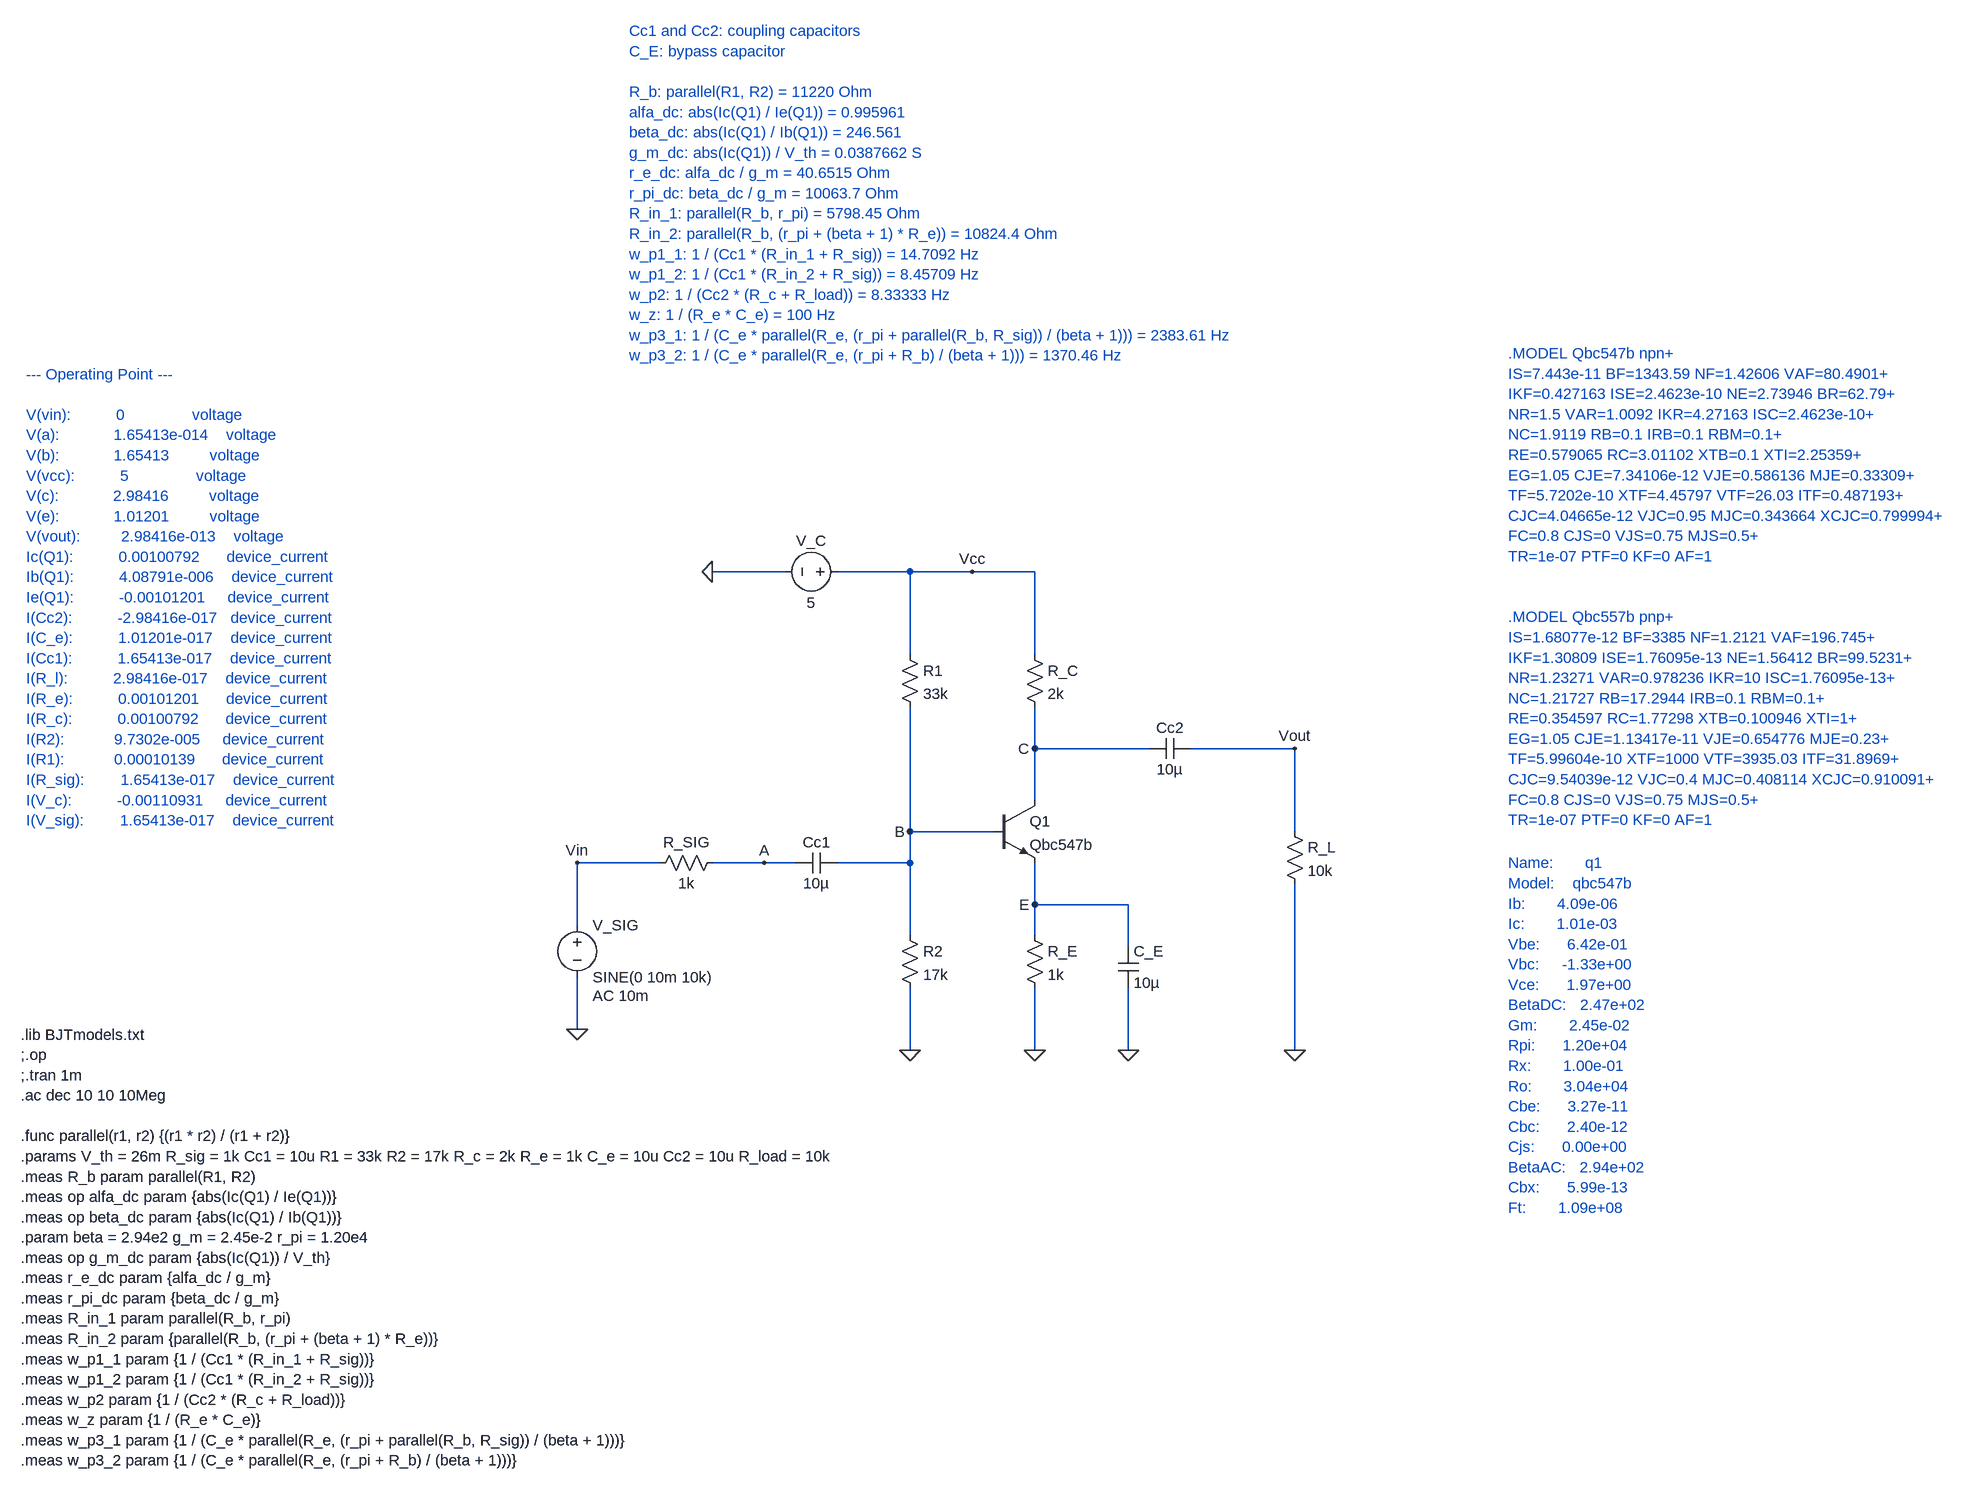
[diagram p0: schematic CE_amp.asc]
CE_amp.asc, the LTspice schematic file:
Version 4
SHEET 1 2012 980
WIRE 176 -336 64 -336
WIRE 368 -336 256 -336
WIRE 464 -336 368 -336
WIRE 560 -336 464 -336
WIRE 368 -208 368 -336
WIRE 560 -208 560 -336
WIRE 560 -64 560 -128
WIRE 736 -64 560 -64
WIRE 960 -64 800 -64
WIRE 560 16 560 -64
WIRE 368 64 368 -128
WIRE 496 64 368 64
WIRE 960 64 960 -64
WIRE -16 112 -144 112
WIRE 144 112 64 112
WIRE 192 112 144 112
WIRE 368 112 368 64
WIRE 368 112 256 112
WIRE 560 176 560 112
WIRE 704 176 560 176
WIRE -144 208 -144 112
WIRE 368 224 368 112
WIRE 560 224 560 176
WIRE 704 240 704 176
WIRE -144 368 -144 288
WIRE 368 400 368 304
WIRE 560 400 560 304
WIRE 704 400 704 304
WIRE 960 400 960 144
FLAG -144 368 0
FLAG 368 400 0
FLAG 64 -336 0
FLAG 560 400 0
FLAG 704 400 0
FLAG 960 400 0
FLAG 560 -64 C
FLAG 560 176 E
FLAG 368 64 B
FLAG -144 112 Vin
FLAG 144 112 A
FLAG 960 -64 Vout
FLAG 464 -336 Vcc
SYMBOL voltage -144 192 R0
WINDOW 123 24 124 Left 2
WINDOW 39 0 0 Left 0
SYMATTR Value2 AC 10m
SYMATTR InstName V_SIG
SYMATTR Value SINE(0 10m 10k)
SYMBOL res 80 96 R90
WINDOW 0 0 56 VBottom 2
WINDOW 3 32 56 VTop 2
SYMATTR InstName R_SIG
SYMATTR Value 1k
SYMBOL cap 256 96 R90
WINDOW 0 0 32 VBottom 2
WINDOW 3 32 32 VTop 2
SYMATTR InstName Cc1
SYMATTR Value 10µ
SYMBOL res 352 -224 R0
SYMATTR InstName R1
SYMATTR Value 33k
SYMBOL res 352 208 R0
SYMATTR InstName R2
SYMATTR Value 17k
SYMBOL voltage 272 -336 R90
WINDOW 0 -32 56 VBottom 2
WINDOW 3 32 56 VTop 2
SYMATTR InstName V_C
SYMATTR Value 5
SYMBOL res 544 -224 R0
SYMATTR InstName R_C
SYMATTR Value 2k
SYMBOL res 544 208 R0
SYMATTR InstName R_E
SYMATTR Value 1k
SYMBOL cap 688 240 R0
SYMATTR InstName C_E
SYMATTR Value 10µ
SYMBOL cap 800 -80 R90
WINDOW 0 0 32 VBottom 2
WINDOW 3 32 32 VTop 2
SYMATTR InstName Cc2
SYMATTR Value 10µ
SYMBOL res 944 48 R0
SYMATTR InstName R_L
SYMATTR Value 10k
SYMBOL npn 496 16 R0
SYMATTR InstName Q1
SYMATTR Value Qbc547b
TEXT -1000 376 Left 2 !.lib BJTmodels.txt\n;.op\n;.tran 1m\n.ac dec 10 10 10Meg\n \n.func parallel(r1, r2) {(r1 * r2) / (r1 + r2)}\n.params V_th = 26m R_sig = 1k Cc1 = 10u R1 = 33k R2 = 17k R_c = 2k R_e = 1k C_e = 10u Cc2 = 10u R_load = 10k\n.meas R_b param parallel(R1, R2)\n.meas op alfa_dc param {abs(Ic(Q1) / Ie(Q1))}\n.meas op beta_dc param {abs(Ic(Q1) / Ib(Q1))}\n.param beta = 2.94e2 g_m = 2.45e-2 r_pi = 1.20e4\n.meas op g_m_dc param {abs(Ic(Q1)) / V_th}\n.meas r_e_dc param {alfa_dc / g_m}\n.meas r_pi_dc param {beta_dc / g_m}\n.meas R_in_1 param parallel(R_b, r_pi)\n.meas R_in_2 param {parallel(R_b, (r_pi + (beta + 1) * R_e))}\n.meas w_p1_1 param {1 / (Cc1 * (R_in_1 + R_sig))}\n.meas w_p1_2 param {1 / (Cc1 * (R_in_2 + R_sig))}\n.meas w_p2 param {1 / (Cc2 * (R_c + R_load))}\n.meas w_z param {1 / (R_e * C_e)}\n.meas w_p3_1 param {1 / (C_e * parallel(R_e, (r_pi + parallel(R_b, R_sig)) / (beta + 1)))}\n.meas w_p3_2 param {1 / (C_e * parallel(R_e, (r_pi + R_b) / (beta + 1)))}
TEXT 1288 -672 Left 2 ;.MODEL Qbc547b npn+\nIS=7.443e-11 BF=1343.59 NF=1.42606 VAF=80.4901+\nIKF=0.427163 ISE=2.4623e-10 NE=2.73946 BR=62.79+\nNR=1.5 VAR=1.0092 IKR=4.27163 ISC=2.4623e-10+\nNC=1.9119 RB=0.1 IRB=0.1 RBM=0.1+\nRE=0.579065 RC=3.01102 XTB=0.1 XTI=2.25359+\nEG=1.05 CJE=7.34106e-12 VJE=0.586136 MJE=0.33309+\nTF=5.7202e-10 XTF=4.45797 VTF=26.03 ITF=0.487193+\nCJC=4.04665e-12 VJC=0.95 MJC=0.343664 XCJC=0.799994+\nFC=0.8 CJS=0 VJS=0.75 MJS=0.5+\nTR=1e-07 PTF=0 KF=0 AF=1\n \n \n.MODEL Qbc557b pnp+\nIS=1.68077e-12 BF=3385 NF=1.2121 VAF=196.745+\nIKF=1.30809 ISE=1.76095e-13 NE=1.56412 BR=99.5231+\nNR=1.23271 VAR=0.978236 IKR=10 ISC=1.76095e-13+\nNC=1.21727 RB=17.2944 IRB=0.1 RBM=0.1+\nRE=0.354597 RC=1.77298 XTB=0.100946 XTI=1+\nEG=1.05 CJE=1.13417e-11 VJE=0.654776 MJE=0.23+\nTF=5.99604e-10 XTF=1000 VTF=3935.03 ITF=31.8969+\nCJC=9.54039e-12 VJC=0.4 MJC=0.408114 XCJC=0.910091+\nFC=0.8 CJS=0 VJS=0.75 MJS=0.5+\nTR=1e-07 PTF=0 KF=0 AF=1
TEXT -64 -1168 Left 2 ;Cc1 and Cc2: coupling capacitors\nC_E: bypass capacitor\n \nR_b: parallel(R1, R2) = 11220 Ohm\nalfa_dc: abs(Ic(Q1) / Ie(Q1)) = 0.995961\nbeta_dc: abs(Ic(Q1) / Ib(Q1)) = 246.561\ng_m_dc: abs(Ic(Q1)) / V_th = 0.0387662 S\nr_e_dc: alfa_dc / g_m = 40.6515 Ohm\nr_pi_dc: beta_dc / g_m = 10063.7 Ohm\nR_in_1: parallel(R_b, r_pi) = 5798.45 Ohm\nR_in_2: parallel(R_b, (r_pi + (beta + 1) * R_e)) = 10824.4 Ohm\nw_p1_1: 1 / (Cc1 * (R_in_1 + R_sig)) = 14.7092 Hz\nw_p1_2: 1 / (Cc1 * (R_in_2 + R_sig)) = 8.45709 Hz\nw_p2: 1 / (Cc2 * (R_c + R_load)) = 8.33333 Hz\nw_z: 1 / (R_e * C_e) = 100 Hz\nw_p3_1: 1 / (C_e * parallel(R_e, (r_pi + parallel(R_b, R_sig)) / (beta + 1))) = 2383.61 Hz\nw_p3_2: 1 / (C_e * parallel(R_e, (r_pi + R_b) / (beta + 1))) = 1370.46 Hz
TEXT -992 -640 Left 2 ;--- Operating Point ---\n \nV(vin):          0               voltage\nV(a):            1.65413e-014    voltage\nV(b):            1.65413         voltage\nV(vcc):          5               voltage\nV(c):            2.98416         voltage\nV(e):            1.01201         voltage\nV(vout):         2.98416e-013    voltage\nIc(Q1):          0.00100792      device_current\nIb(Q1):          4.08791e-006    device_current\nIe(Q1):          -0.00101201     device_current\nI(Cc2):          -2.98416e-017   device_current\nI(C_e):          1.01201e-017    device_current\nI(Cc1):          1.65413e-017    device_current\nI(R_l):          2.98416e-017    device_current\nI(R_e):          0.00101201      device_current\nI(R_c):          0.00100792      device_current\nI(R2):           9.7302e-005     device_current\nI(R1):           0.00010139      device_current\nI(R_sig):        1.65413e-017    device_current\nI(V_c):          -0.00110931     device_current\nI(V_sig):        1.65413e-017    device_current
TEXT 1288 112 Left 2 ;Name:       q1\nModel:    qbc547b\nIb:       4.09e-06\nIc:       1.01e-03\nVbe:      6.42e-01\nVbc:     -1.33e+00\nVce:      1.97e+00\nBetaDC:   2.47e+02\nGm:       2.45e-02\nRpi:      1.20e+04\nRx:       1.00e-01\nRo:       3.04e+04\nCbe:      3.27e-11\nCbc:      2.40e-12\nCjs:      0.00e+00\nBetaAC:   2.94e+02\nCbx:      5.99e-13\nFt:       1.09e+08

The netlist it stands for:
* CE_amp.asc
V_SIG Vin 0 SINE(0 10m 10k) AC 10m
R_SIG A Vin 1k
Cc1 B A 10µ
R1 Vcc B 33k
R2 B 0 17k
V_C Vcc 0 5
R_C Vcc C 2k
R_E E 0 1k
C_E E 0 10µ
Cc2 Vout C 10µ
R_L Vout 0 10k
Q1 C B E 0 Qbc547b
.model NPN NPN
.model PNP PNP
.lib standard.bjt
.lib BJTmodels.txt
;.op
;.tran 1m
.ac dec 10 10 10Meg
.func parallel(r1, r2) {(r1 * r2) / (r1 + r2)}
.params V_th = 26m R_sig = 1k Cc1 = 10u R1 = 33k R2 = 17k R_c = 2k R_e = 1k C_e = 10u Cc2 = 10u R_load = 10k
.meas R_b param parallel(R1, R2)
.meas op alfa_dc param {abs(Ic(Q1) / Ie(Q1))}
.meas op beta_dc param {abs(Ic(Q1) / Ib(Q1))}
.param beta = 2.94e2 g_m = 2.45e-2 r_pi = 1.20e4
.meas op g_m_dc param {abs(Ic(Q1)) / V_th}
.meas r_e_dc param {alfa_dc / g_m}
.meas r_pi_dc param {beta_dc / g_m}
.meas R_in_1 param parallel(R_b, r_pi)
.meas R_in_2 param {parallel(R_b, (r_pi + (beta + 1) * R_e))}
.meas w_p1_1 param {1 / (Cc1 * (R_in_1 + R_sig))}
.meas w_p1_2 param {1 / (Cc1 * (R_in_2 + R_sig))}
.meas w_p2 param {1 / (Cc2 * (R_c + R_load))}
.meas w_z param {1 / (R_e * C_e)}
.meas w_p3_1 param {1 / (C_e * parallel(R_e, (r_pi + parallel(R_b, R_sig)) / (beta + 1)))}
.meas w_p3_2 param {1 / (C_e * parallel(R_e, (r_pi + R_b) / (beta + 1)))}
* .MODEL Qbc547b npn+
* IS=7.443e-11 BF=1343.59 NF=1.42606 VAF=80.4901+
* IKF=0.427163 ISE=2.4623e-10 NE=2.73946 BR=62.79+
* NR=1.5 VAR=1.0092 IKR=4.27163 ISC=2.4623e-10+
* NC=1.9119 RB=0.1 IRB=0.1 RBM=0.1+
* RE=0.579065 RC=3.01102 XTB=0.1 XTI=2.25359+
* EG=1.05 CJE=7.34106e-12 VJE=0.586136 MJE=0.33309+
* TF=5.7202e-10 XTF=4.45797 VTF=26.03 ITF=0.487193+
* CJC=4.04665e-12 VJC=0.95 MJC=0.343664 XCJC=0.799994+
* FC=0.8 CJS=0 VJS=0.75 MJS=0.5+
* TR=1e-07 PTF=0 KF=0 AF=1
* .MODEL Qbc557b pnp+
* IS=1.68077e-12 BF=3385 NF=1.2121 VAF=196.745+
* IKF=1.30809 ISE=1.76095e-13 NE=1.56412 BR=99.5231+
* NR=1.23271 VAR=0.978236 IKR=10 ISC=1.76095e-13+
* NC=1.21727 RB=17.2944 IRB=0.1 RBM=0.1+
* RE=0.354597 RC=1.77298 XTB=0.100946 XTI=1+
* EG=1.05 CJE=1.13417e-11 VJE=0.654776 MJE=0.23+
* TF=5.99604e-10 XTF=1000 VTF=3935.03 ITF=31.8969+
* CJC=9.54039e-12 VJC=0.4 MJC=0.408114 XCJC=0.910091+
* FC=0.8 CJS=0 VJS=0.75 MJS=0.5+
* TR=1e-07 PTF=0 KF=0 AF=1
* Cc1 and Cc2: coupling capacitors
* C_E: bypass capacitor
* R_b: parallel(R1, R2) = 11220 Ohm
* alfa_dc: abs(Ic(Q1) / Ie(Q1)) = 0.995961
* beta_dc: abs(Ic(Q1) / Ib(Q1)) = 246.561
* g_m_dc: abs(Ic(Q1)) / V_th = 0.0387662 S
* r_e_dc: alfa_dc / g_m = 40.6515 Ohm
* r_pi_dc: beta_dc / g_m = 10063.7 Ohm
* R_in_1: parallel(R_b, r_pi) = 5798.45 Ohm
* R_in_2: parallel(R_b, (r_pi + (beta + 1) * R_e)) = 10824.4 Ohm
* w_p1_1: 1 / (Cc1 * (R_in_1 + R_sig)) = 14.7092 Hz
* w_p1_2: 1 / (Cc1 * (R_in_2 + R_sig)) = 8.45709 Hz
* w_p2: 1 / (Cc2 * (R_c + R_load)) = 8.33333 Hz
* w_z: 1 / (R_e * C_e) = 100 Hz
* w_p3_1: 1 / (C_e * parallel(R_e, (r_pi + parallel(R_b, R_sig)) / (beta + 1))) = 2383.61 Hz
* w_p3_2: 1 / (C_e * parallel(R_e, (r_pi + R_b) / (beta + 1))) = 1370.46 Hz
* --- Operating Point ---
* V(vin):          0               voltage
* V(a):            1.65413e-014    voltage
* V(b):            1.65413         voltage
* V(vcc):          5               voltage
* V(c):            2.98416         voltage
* V(e):            1.01201         voltage
* V(vout):         2.98416e-013    voltage
* Ic(Q1):          0.00100792      device_current
* Ib(Q1):          4.08791e-006    device_current
* Ie(Q1):          -0.00101201     device_current
* I(Cc2):          -2.98416e-017   device_current
* I(C_e):          1.01201e-017    device_current
* I(Cc1):          1.65413e-017    device_current
* I(R_l):          2.98416e-017    device_current
* I(R_e):          0.00101201      device_current
* I(R_c):          0.00100792      device_current
* I(R2):           9.7302e-005     device_current
* I(R1):           0.00010139      device_current
* I(R_sig):        1.65413e-017    device_current
* I(V_c):          -0.00110931     device_current
* I(V_sig):        1.65413e-017    device_current
* Name:       q1
* Model:    qbc547b
* Ib:       4.09e-06
* Ic:       1.01e-03
* Vbe:      6.42e-01
* Vbc:     -1.33e+00
* Vce:      1.97e+00
* BetaDC:   2.47e+02
* Gm:       2.45e-02
* Rpi:      1.20e+04
* Rx:       1.00e-01
* Ro:       3.04e+04
* Cbe:      3.27e-11
* Cbc:      2.40e-12
* Cjs:      0.00e+00
* BetaAC:   2.94e+02
* Cbx:      5.99e-13
* Ft:       1.09e+08
.backanno
.end